# EAGLE design Adafruit TRRS Trinkey (EAGLE 9.6.2)
AUTHOR: ladyada
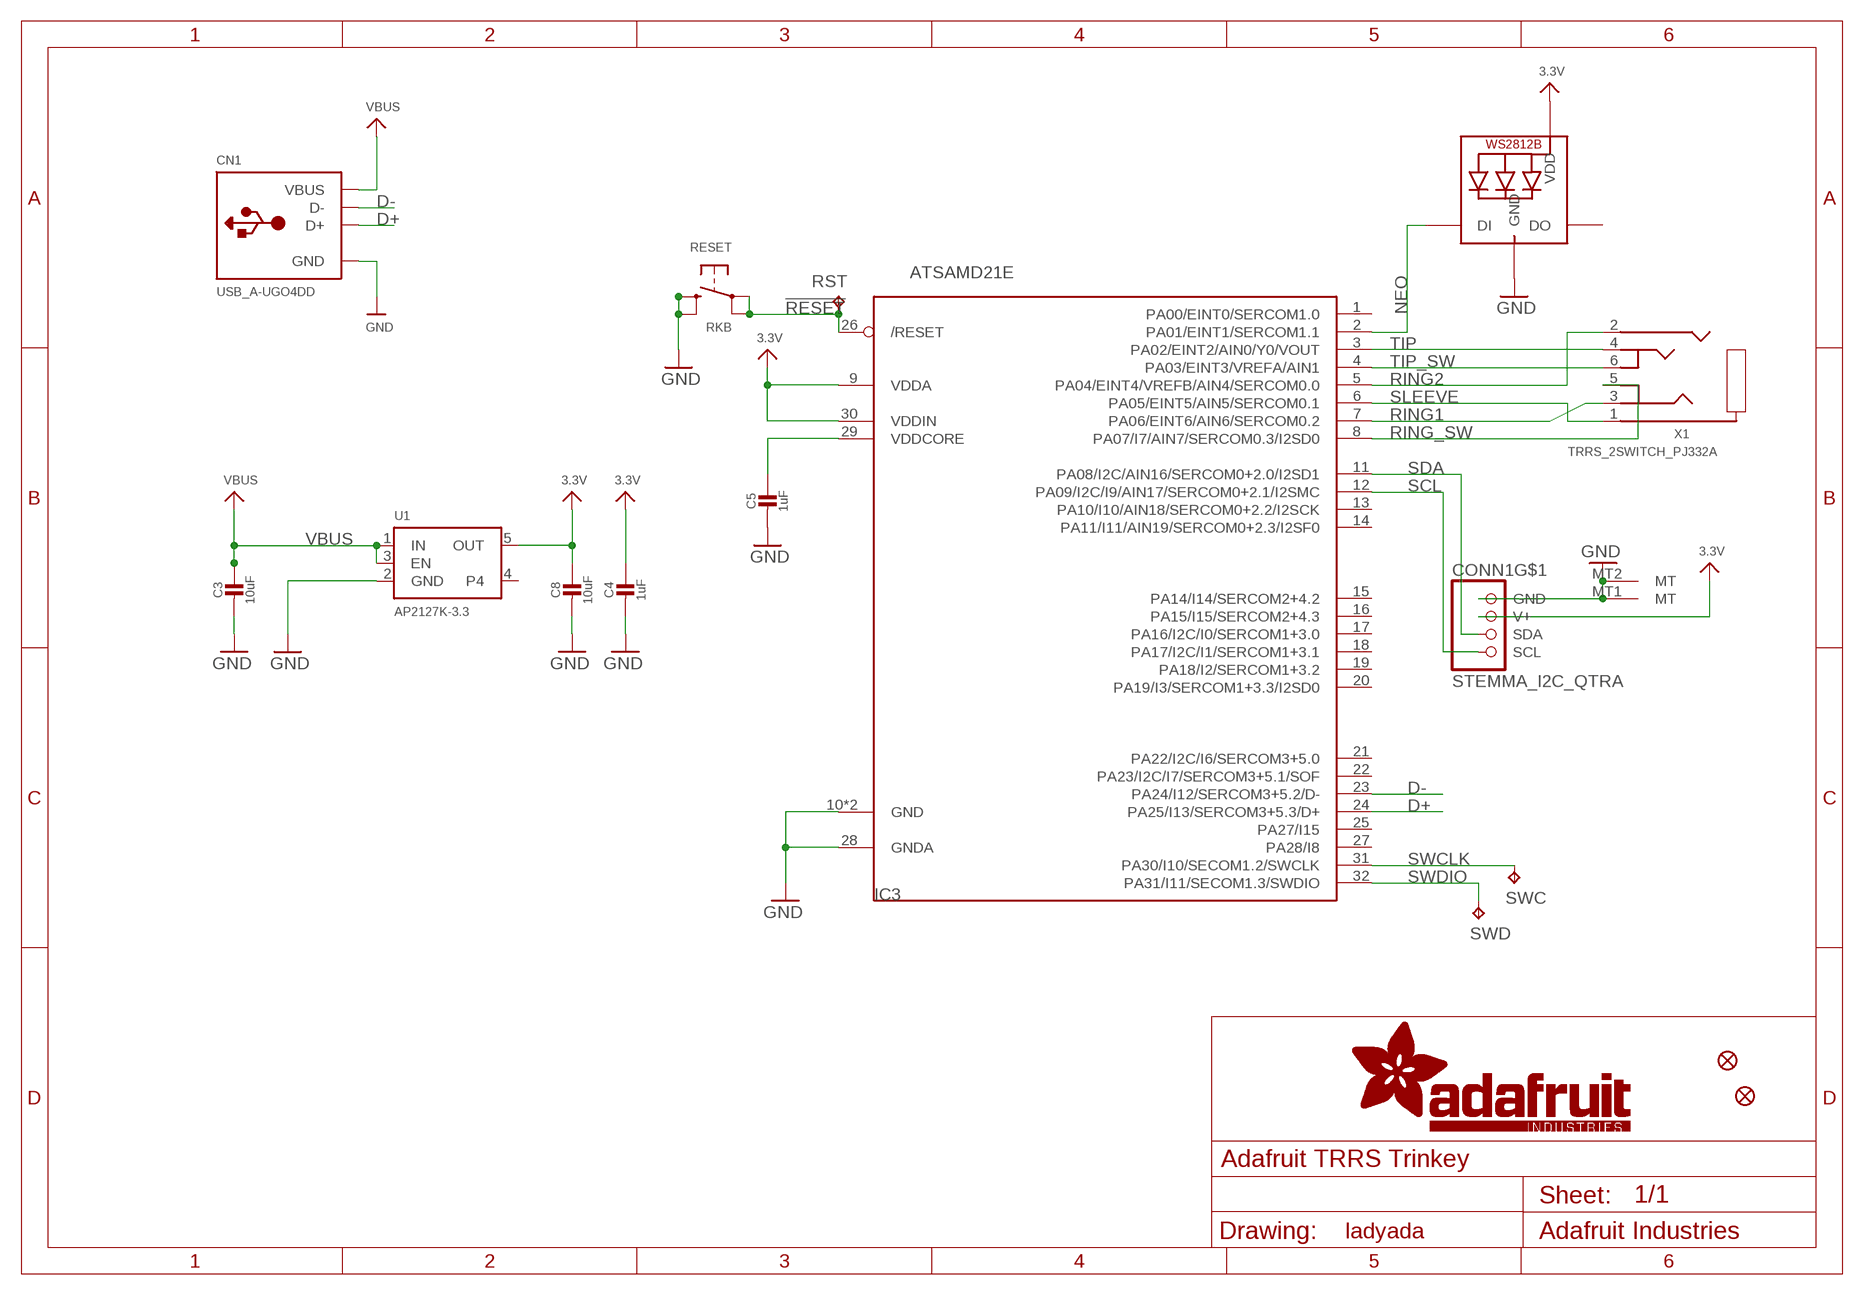
[diagram p0: schematic, sheet 1]

## Parts
C3  10uF  CAP_CERAMIC0805-NOOUTLINE  [0805-NO]
C4  1uF  CAP_CERAMIC0603_NO  [0603-NO]
C5  1uF  CAP_CERAMIC0603_NO  [0603-NO]
C8  10uF  CAP_CERAMIC0805-NOOUTLINE  [0805-NO]
CN1  USB_A-UGO4DD  USB_TYPEA_UG04DD  [USB_A-UGO4DD]
CONN1  STEMMA_I2C_QTRA  [JST_SH4_RA]
FID1  FIDUCIAL_0.5MM  [FIDUCIAL_0.5MM]
FID2  FIDUCIAL_0.5MM  [FIDUCIAL_0.5MM]
IC3  ATSAMD21E  [QFN32_5MM]
LED1  WS2812B_SK6805_1515  [SK6805_1515]
RESET  RKB  SWITCH_TACT_SMT_RKB2  [BTN_RKB2_4.6X2.8]
RST  TPTP16R  [TP16R]
SWC  TPTP15R  [TP15R]
SWD  TPTP16R  [TP16R]
U1  AP2127K-3.3  VREG_SOT23-5  [SOT23-5]
X1  TRRS_2SWITCH_PJ332A  [PJ-332A]

## Nets
3.3V: C4.1 C8.1 CONN1.2(V+) IC3.9(VDDA) IC3.30(VDDIN) LED1.2(VDD) U1.5(OUT)
!RESET: IC3.26(/RESET) RESET.A'(P1) RESET.A(P) RST.TP
D+: CN1.D+ IC3.24(PA25/I13/SERCOM3+5.3/D+)
D-: CN1.D- IC3.23(PA24/I12/SERCOM3+5.2/D-)
GND: C3.2 C4.2 C5.2 C8.2 CN1.GND CONN1.1(GND) CONN1.MT1(MT) CONN1.MT2(MT) IC3.10(GND) IC3.28(GNDA) IC3.33(GND) LED1.4(GND) RESET.B'(S1) RESET.B(S) U1.2(GND)
NEO: IC3.2(PA01/EINT1/SERCOM1.1) LED1.1(DI)
RING1: IC3.7(PA06/EINT6/AIN6/SERCOM0.2) X1.3(RING2)
RING2: IC3.5(PA04/EINT4/VREFB/AIN4/SERCOM0.0) X1.2(RING1)
RING_SW: IC3.8(PA07/I7/AIN7/SERCOM0.3/I2SD0) X1.5(R2_SW)
SCL: CONN1.4(SCL) IC3.12(PA09/I2C/I9/AIN17/SERCOM0+2.1/I2SMC)
SDA: CONN1.3(SDA) IC3.11(PA08/I2C/AIN16/SERCOM0+2.0/I2SD1)
SLEEVE: IC3.6(PA05/EINT5/AIN5/SERCOM0.1) X1.1(RING)
SWCLK: IC3.31(PA30/I10/SECOM1.2/SWCLK) SWC.TP
SWDIO: IC3.32(PA31/I11/SECOM1.3/SWDIO) SWD.TP
TIP: IC3.3(PA02/EINT2/AIN0/Y0/VOUT) X1.4(TIP)
TIP_SW: IC3.4(PA03/EINT3/VREFA/AIN1) X1.6(TIP_SW)
VBUS: C3.1 CN1.VBUS U1.1(IN) U1.3(EN)
VDDCORE1: C5.1 IC3.29(VDDCORE)
Unconnected: IC3.1(PA00/EINT0/SERCOM1.0) IC3.13(PA10/I10/AIN18/SERCOM0+2.2/I2SCK) IC3.14(PA11/I11/AIN19/SERCOM0+2.3/I2SF0) IC3.15(PA14/I14/SERCOM2+4.2) IC3.16(PA15/I15/SERCOM2+4.3) IC3.17(PA16/I2C/I0/SERCOM1+3.0) IC3.18(PA17/I2C/I1/SERCOM1+3.1) IC3.19(PA18/I2/SERCOM1+3.2) IC3.20(PA19/I3/SERCOM1+3.3/I2SD0) IC3.21(PA22/I2C/I6/SERCOM3+5.0) IC3.22(PA23/I2C/I7/SERCOM3+5.1/SOF) IC3.25(PA27/I15) IC3.27(PA28/I8) LED1.3(DO) U1.4

## Library data of the parts
C3-C5 C8 = microbuilder:CAP_CERAMIC: Ceramic Capacitors For new designs, use the packages preceded by an '_' character since they are more reliable: The following footprints should be used on most boards: _0402 - Standard footprint for regular board layouts _0603 - Standard footprint for regular board layouts _0805 - Standard footprint for regular board layouts _1206 - Standard footprint for regular board layouts For extremely tight-pitch boards where space is at a premium, the following 'micro-pitch' footprints can be used (smaller pads, no silkscreen outline, etc.): _0402MP - Micro-pitch footprint for very dense/compact boards _0603MP - Micro-pitch footprint for very dense/compact boards _0805MP - Micro-pitch footprint for very dense/compact boards _1206MP - Micro-pitch footprint for very dense/compact boards
CN1 = adafruit_electromech:USB_TYPEA: USB - Type A Connectors Male types stick out and are inserted into a PC or matching females parts (these are the connectors used on USB Memory Sticks, etc.). Female parts are generally used for USB Host and accept a male-type connector. SMT - 4UCON: 10017 PTHFML - Digikey: 609-1045-ND, 4UCon: 05241 PCB - Use 2.0mm thick PCBs with this footprint
CONN1 = adafruit_electromech:STEMMA_I2C; LCSC: C145961
FID1 FID2 = microbuilder:FIDUCIAL: Fiducial Alignment Points Various fiducial points for machine vision alignment.
IC3 = adafruit_micro:ATSAMD21E; ROT: 270
LED1 = microbuilder:WS2812B; LCSC: C2890035
RESET = adafruit_electromech:SWITCH_TACT_SMT: SMT Tact Switches RKB2 https://www.digikey.com/short/m027prz5
RST SWC SWD = testpad:TP: Test pad
U1 = adafruit_power:VREG_SOT23-5: SOT23-5 Fixed Voltage Regulators Part Current Out V Out V In V Dropout θJA (°C/W) TJ (°C) Digikey Part No. ADP121 150mA 3.3V 3.4-5.5V 0.09V @ 150mA -- -- ADP121-AUJZ33R7CT-ND ADP121 150mA 3.0V 3.1-5.5V 0.09V @ 150mA -- -- ADP121-AUJZ30R7CT-ND ADP122 300mA 3.3V 3.4-5.5V 0.085V @ 300mA -- -- ADP122AUJZ-3.3-R7CT-ND ADP1712 300mA 3.3V 3.5-5.5V 0.17V @ 300mA -- -- ADP1712AUJZ-3.3-R7TR-ND AP7311 (Low Cost) 150mA 3.3V 3.5-6V 0.15V @ 150mA -- -- AP7311-33WG-7DICT-ND LD39015M18R 150mA 1.8V 1.9V-5.5V 0.08V @ 100mA -- -- 497-6977-1-ND LP2985A-33DBVR 150mA 3.3V 3.3-16V 0.28V @ 150mA 206 150 296-18479-1-ND MCP1824T-3302E/OT 300mA 3.3V 3.5V-6V 0.2V @ 300mA -- -- MCP1824T-3302E/OTCT-ND MIC5205-2.5YM5 TR 150mA 2.5V 2.7-16V 0.165V @ 150mA -- -- 576-1257-2-ND MIC5205-3.0YM5 TR 150mA 3.0V 3.2V-16V 0.165V @ 150mA -- -- 576-1258-2-ND MIC5205-3.3YM5 TR 150mA 3.3V 3.5V-16V 0.165V @ 150mA -- -- 576-1259-2-ND TPS780330220 150mA 3.3V+2.2V 3.6-5.5V 250mV Max -- -- 296-23332-1-ND TDA3663/N1,135 100mA 3.3V 3.5-45V 0.18V @ 50mA -- -- 568-5343-1-ND Max operating temp can be calculated using θJA, TJ (max junction temperature), and power in watts. Set the "Maximum Ambient Temperature" until it reaches TJ ("Max Junction Temperature"), which is the absolute limit for safe use of the regulator: Heat Sink Temperature Calculator <http://www.daycounter.com/Calculators/Heat-Sink-Temperature-Calculator.phtml> For example, With 12V source into a 3.3V LP2985 and a 30mA load, we are dissipating (12V-3.3V) * 0.03A = 0.261W. With a θJA of 206 °C/W, a TJ of 150°C, and 261mW we can safely use the chip without a heat sink up to 75°C (=147.1°C Junction Temperature).; JLC_ROTATION: 0
X1 = adafruit_electromech:TRRS_2SWITCH

## Board
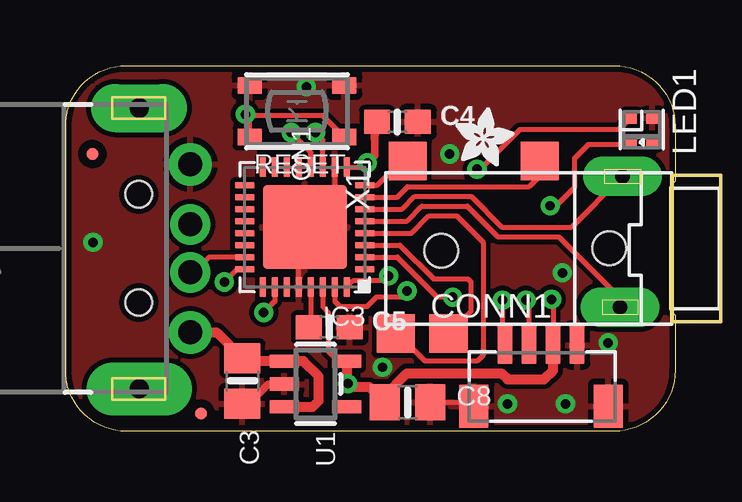
[diagram p1: board, top side]
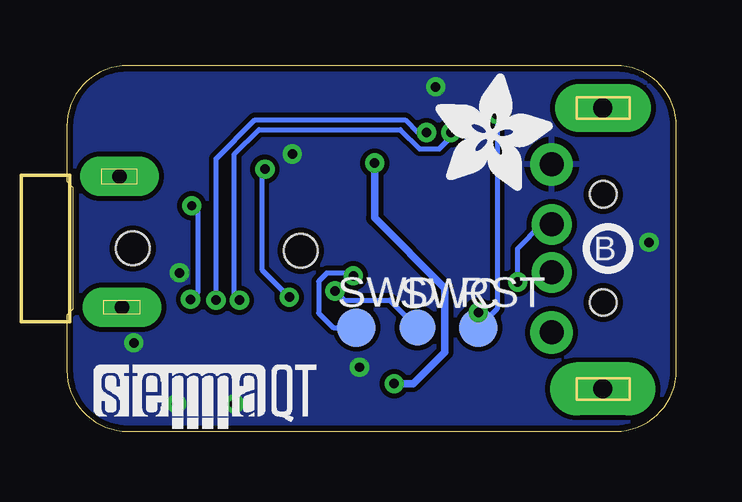
[diagram p2: board, bottom side, seen from below]

Size 25.4 x 15.24 mm. Coordinates in mm from the lower left corner, seen from the top.
Outline: 2.54,15.24 22.86,15.24 arc-90 25.4,12.7 25.4,10.41 25.15,10.16 25.15,5.08 25.4,4.83 25.4,2.54 arc-90 22.86,0 2.54,0 arc-90 0,2.54 0,12.7 arc-90 2.54,15.24
Copper layers (1*16): Top 0.035mm / dielectric 1.5mm / Bottom 0.035mm
Design rules "adafruit 7-7": minimum track width 6mil, minimum drill 15.5mil, track to track 8mil, track to pad 7mil, pad to pad 7mil, via to via 7mil, smd to smd 7mil, copper to edge 10mil, drill to drill 8mil, minimum pad ring 10mil, minimum via ring 8mil, stop-mask expansion 2mil, vias tented up to drill 20mil, thermal gap 10mil

### Footprints (pad centres in the part's own frame; a part is rotated, then mirrored left to right if it is on the bottom)
0805-NO = smd 1.24 x 1.5: 1 -0.95,0; 2 0.95,0
0603-NO = smd 1.075 x 1: 1 -0.85,0; 2 0.85,0
USB_A-UGO4DD = drill 1 pad 1.676: D+ -1,2.15; D- 1,2.15 | drill 1 pad 1.778: GND -3.5,2.15; VBUS 3.5,2.15 | drill 0.8 pad 2.2 long: MNT1 5.85,0.02 | drill 0.8 pad 2 long: MNT2 -5.85,0.02 | hole 1.1: 2.25,0; -2.25,0
JST_SH4_RA = smd 0.6 x 1.55: 1 1.5,0.924; 2 0.5,0.924; 3 -0.5,0.924; 4 -1.5,0.924 | smd 1.2 x 1.8: MT1 -2.8,-1.624; MT2 2.8,-1.624
FIDUCIAL_0.5MM = smd 0.5 x 0.5: 1 0,0
QFN32_5MM = smd 0.8 x 0.25: 1 -2.5,1.75; 2 -2.5,1.25; 3 -2.5,0.75; 4 -2.5,0.25; 5 -2.5,-0.25; 6 -2.5,-0.75; 7 -2.5,-1.25; 8 -2.5,-1.75; 17 2.5,-1.75; 18 2.5,-1.25; 19 2.5,-0.75; 20 2.5,-0.25; 21 2.5,0.25; 22 2.5,0.75; 23 2.5,1.25; 24 2.5,1.75 | smd 0.25 x 0.8: 9 -1.75,-2.5; 10 -1.25,-2.5; 11 -0.75,-2.5; 12 -0.25,-2.5; 13 0.25,-2.5; 14 0.75,-2.5; 15 1.25,-2.5; 16 1.75,-2.5; 25 1.75,2.5; 26 1.25,2.5; 27 0.75,2.5; 28 0.25,2.5; 29 -0.25,2.5; 30 -0.75,2.5; 31 -1.25,2.5; 32 -1.75,2.5 | smd 3.5 x 3.5: 33 0,0
SK6805_1515 = smd 0.5 x 0.5: 1 -0.5,-0.45; 2 0.5,-0.45; 3 0.5,0.45; 4 -0.5,0.45
BTN_RKB2_4.6X2.8 = smd 1 x 0.7: A 1.973,1.075; A' -1.973,1.075; B 1.973,-1.075; B' -1.973,-1.075
TP16R = smd 1.6 x 1.6: TP 0,0
TP15R = smd 1.5 x 1.5: TP 0,0
SOT23-5 = smd 0.55 x 1.2: 1 -0.95,-1.3; 2 0,-1.3; 3 0.95,-1.3; 4 0.95,1.3; 5 -0.95,1.3
PJ-332A = drill 0.6 pad 1.651 long: 1 -4.792,-3; 2 -4.692,2.45 | smd 1.6 x 1.6: 3 -1.342,-3.65; 4 2.458,3.55; 5 4.158,-3.65; 6 4.658,3.55 | hole 1.4: -4.242,0; 2.758,0.1

### Placement (x,y rotation side)
C3  7.37,2.1 270 top
C4  13.83,12.89 0 top
C5  10.99,4.33 0 top
C8  14.25,1.21 0 top
CN1  3.05,7.62 270 top
CONN1  19.81,2.67 0 top
FID1  1.12,11.56 0 top
FID2  5.64,0.74 0 top
IC3  9.97,8.51 180 top
LED1  24,12.57 270 top
PLABEL4  [PLABEL4]  8.38,5.78 0 bottom
PLABEL5  [PLABEL5]  10.67,2.98 0 bottom
PLABEL6  [PLABEL6]  13.27,5.65 0 bottom
PLABEL9  [PLABEL9]  6.53,13.3 90 top
PLABEL10  [PLABEL10]  12.32,13.72 0 top
PLABEL11  [PLABEL11]  24.51,1.14 90 top
PLABEL12  [PLABEL12]  19.94,12.19 0 top
PLABEL13  [PLABEL13]  21.21,8 0 bottom
RESET  9.64,13.34 180 top
RST  8.26,4.32 0 bottom
SWC  10.79,4.32 0 bottom
SWD  13.34,4.32 0 bottom
U1  10.41,1.97 270 top
U$4  [ADAFRUIT_2.5MM]  16.26,11.05 0 top
U$5  [STEMMAQT]  24.26,0.13 0 bottom
U$7  [ADAFRUIT_5MM]  10.03,10.03 0 bottom
U$8  [PCBFEAT-REV-040]  2.86,7.62 180 bottom
X1  18.41,7.62 180 top

### Tracks (layer width: path | path; a pad name or v marks a point on that pad's centre or on a via)
3.3V  (via drill 0.39)
  Top 0.203: IC3.30 10.72,5.18 10.95,4.95 10.95,3.33 11.37,2.92 U1.5 | C4.1 12.87,11.4 12.48,11.01 IC3.9 | CONN1.2 20.31,5.14 20.1,5.36 v20.24,5.5 | v20.19,9.4 20.45,9.4 21.21,10.16 21.21,11.38 21.77,11.95 23.43,11.95 LED1.2
  Top 0.305: C4.1 12.86,12.77 12.88,11.49 v12.57,11.18
  Top 0.406: U1.5 11.71,2.03 v11.76,1.98 11.9,1.84 12.66,1.84 C8.1 13.3,1.49 14.22,2.41 18.16,2.41 18.41,2.16 19.94,2.16 20.31,2.53 CONN1.2
  Bottom 0.203: v20.19,9.4 19.94,9.14 19.94,5.8 v20.24,5.5
  Bottom 0.305: v12.57,11.18 12.57,8.89 9.65,5.97 9.65,3.3 10.97,1.98 v11.76,1.98
!RESET  (via drill 0.39)
  Top 0.203: IC3.26 8.72,5.42 v8.26,4.95 | RESET.A' 10.72,13.15 7.75,13.15 | v7.49,13.21 7.55,13.15 7.75,13.15 | RESET.A 7.67,13.07 7.75,13.15
  Bottom 0.203: v8.26,4.95 RST.TP 7.46,5.11 7.46,13.17 v7.49,13.21
D+  (via drill 0.39)
  Top 0.203: v6.61,6.22 7.15,6.76 IC3.24
  Bottom 0.203: v6.61,6.22 6.61,7.61 5.6,8.62 CN1.D+
D-
  Top 0.203: IC3.23 5.99,7.26 5.35,6.62 CN1.D-
GND  (via drill 0.39)
  Top 0.203: IC3.28 9.72,8.51 IC3.33 11.22,8.51 IC3.10 | C8.2 16.85,1.21 CONN1.MT1
  Top 0.305: U1.2 8.44,1.97 7.62,1.15 C3.2
  other vias: 22.61,3.68 16,11.56 10.03,14.35 13.21,2.67 18.41,1.14 20.83,1.14 1.14,7.87 20.7,6.6
  pour Top: 0,15.24 25.53,15.24 25.53,0 0,0
  pour Bottom: 0,15.24 25.53,15.24 25.53,0 0,0
NEO  (via drill 0.39)
  Top 0.203: IC3.2 13.82,7.26 15.49,5.59 v16.13,5.59 | LED1.1 23.05,12.57 18.91,12.57 17.27,10.92 v17.14,10.92
  Bottom 0.203: v17.14,10.92 17.27,10.79 17.27,6.73 v16.13,5.59
RING1
  Top 0.203: IC3.7 13.82,9.76 14.26,10.19 19.31,10.19 19.76,10.63 X1.3
RING2
  Top 0.203: IC3.5 14.23,8.76 14.85,9.38 16.74,9.38 18.03,8.09 20.57,8.09 23.11,5.55 X1.2
RING_SW
  Top 0.203: IC3.8 12.99,10.26 14,11.27 X1.5
SCL  (via drill 0.39)
  Top 0.203: v18.2,5.46 18.19,5.44 18.19,3.72 CONN1.4 | IC3.12 10.22,11.62 v9.4,12.45
  Bottom 0.203: v18.2,5.46 18.41,5.67 18.41,11.56 17.4,12.57 11.5,12.57 10.7,11.77 9.88,11.77 9.4,12.25 v9.4,12.45
SDA  (via drill 0.39)
  Top 0.203: CONN1.3 19.31,5.33 v19.18,5.46 | IC3.11 10.72,12.14 v10.41,12.45
  Bottom 0.203: v19.18,5.46 19.18,11.36 17.57,12.98 11.3,12.98 10.77,12.45 v10.41,12.45
SLEEVE
  Top 0.203: IC3.6 14.03,9.26 14.55,9.78 16.91,9.78 18.18,8.51 21.08,8.51 23.19,10.62 X1.1
SWCLK  (via drill 0.39)
  Top 0.203: IC3.31 11.22,5.42 11.43,5.21 12.57,5.21 12.95,5.59 13.97,5.59 v14.22,5.84
  Bottom 0.203: v14.22,5.84 13.84,5.46 11.94,5.46 SWC.TP
SWDIO  (via drill 0.39)
  Top 0.203: IC3.32 11.97,6.26 13.25,6.26 v13.46,6.48
  Bottom 0.203: v13.46,6.48 13.72,6.48 13.84,6.6 14.55,6.6 14.9,6.25 14.9,4.93 14.3,4.32 SWD.TP
TIP
  Top 0.203: IC3.3 13.93,7.76 15.33,6.35 16.76,6.35 16.89,6.22 16.89,5 X1.4
TIP_SW
  Top 0.203: IC3.4 14.43,8.26 15.14,8.97 16.3,8.97 17.4,7.87 17.4,3.17 17.14,2.92 14.99,2.92 13.84,4.07 X1.6
VBUS
  Top 0.406: CN1.VBUS 6.29,4.12 C3.1 7.49,2.92 U1.1 9.91,2.92 10.54,2.29 10.54,1.27 10.29,1.02 U1.3
VDDCORE1
  Top 0.203: IC3.29 10.22,4.42 C5.1

### Text on the board
tValues: C1898
Pinguin_tBackup: TRRS Trinkey | Neo | I2C
Pinguin_bBackup: TRRS Jack / Trinkey w/ / SAMD21E18